# Altium schematic sheet ADC.SchDoc: ADC
size OrCAD A; DocumentNumber: LM-003; Revision: C; SheetNumber: 4; SheetTotal: 4
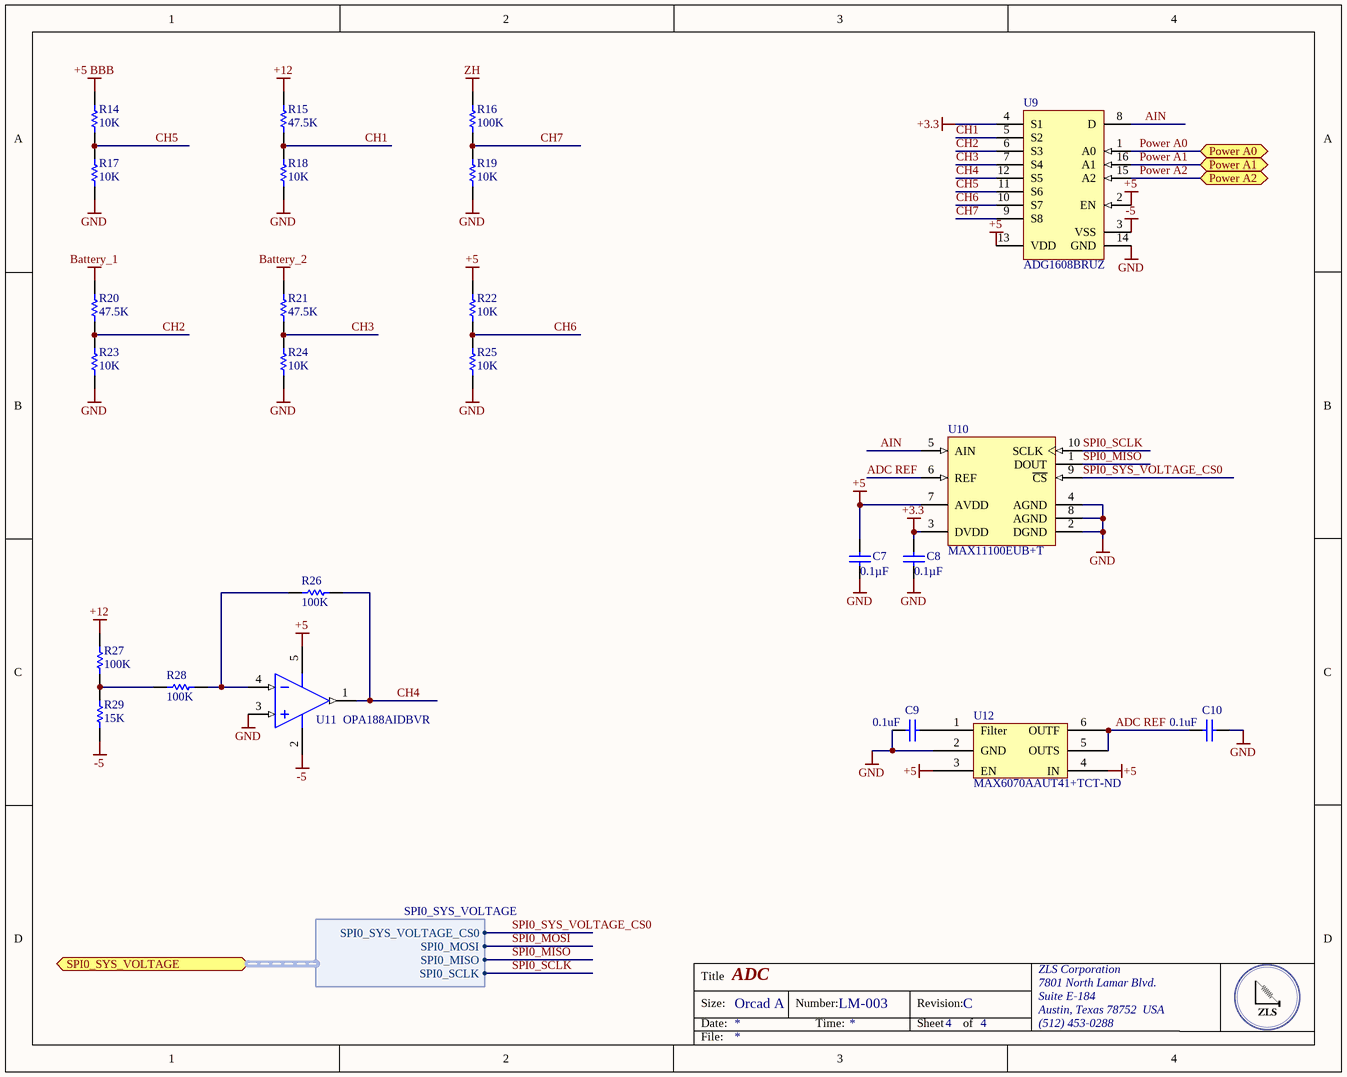
[diagram p0: ADC.SchDoc]

## Parts
C7  Capacitance: 0.1µF  [CAPC0805(2012)145_N]  (hidden comment: CAP CER 0.1UF 25V X7R 0805)
C8  Capacitance: 0.1µF  [CAPC0805(2012)145_N]  (hidden comment: CAP CER 0.1UF 25V X7R 0805)
C9  0.1uF  [CAPC0402(1005)60_L]
C10  0.1uF  [CAPC0402(1005)60_L]
R14  10K  [RESC0805(2012)_L]
R15  47.5K  [RESC0805(2012)_L]
R16  100K  [RESC0805(2012)_L]
R17  10K  [RESC0805(2012)_L]
R18  10K  [RESC0805(2012)_L]
R19  10K  [RESC0805(2012)_L]
R20  47.5K  [RESC0805(2012)_L]
R21  47.5K  [RESC0805(2012)_L]
R22  10K  [RESC0805(2012)_L]
R23  10K  [RESC0805(2012)_L]
R24  10K  [RESC0805(2012)_L]
R25  10K  [RESC0805(2012)_L]
R26  100K  [RESC0805(2012)_L]
R27  100K  [RESC0805(2012)_L]
R28  100K  [RESC0805(2012)_L]
R29  15K  [RESC0805(2012)_L]
U9  ADG1608BRUZ  [ADI-RU-16_M]
U10  MAX11100EUB+T  [U10+2_L]
U11  OPA188AIDBVR  [DBV0005A_M]
U12  Supplier Part Number 1: MAX6070AAUT41+TCT-ND  [SOT95P280X445-6N]  (hidden comment: MAX6070AAUT41+T)

## Ports
Power A0, Power A1, Power A2, SPI0_SYS_VOLTAGE (harness SPI0_SYS_VOLTAGE)

## Harnesses
SPI0_SYS_VOLTAGE: SPI0_SYS_VOLTAGE_CS0, SPI0_MOSI, SPI0_MISO, SPI0_SCLK

## Nets
+3.3: C8.1 U9.4(S1) U10.3(DVDD)
+5: C7.1 R22.1 U9.2(EN) U9.13(VDD) U10.7(AVDD) U11.5(V+) U12.3(EN) U12.4(IN)
+5 BBB: R14.1
+12: R15.1 R27.1
-5: R29.2 U9.3(VSS) U11.2(V-)
Battery_1: R20.1
Battery_2: R21.1
GND: C7.2 C8.2 C9.2 C10.1 R17.2 R18.2 R19.2 R23.2 R24.2 R25.2 U9.14(GND) U10.2(DGND) U10.4(AGND) U10.8(AGND) U11.3(IN+) U12.2(GND)
ZH: R16.1
ADC REF: C10.2 U10.6(REF) U12.5(OUTS) U12.6(OUTF)
AIN: U9.8(D) U10.5(AIN)
CH1: R15.2 R18.1 U9.5(S2)
CH2: R20.2 R23.1 U9.6(S3)
CH3: R21.2 R24.1 U9.7(S4)
CH4: R26.2 U9.12(S5) U11.1(OUT)
CH5: R14.2 R17.1 U9.11(S6)
CH6: R22.2 R25.1 U9.10(S7)
CH7: R16.2 R19.1 U9.9(S8)
Power A0: U9.1(A0) ; port Power A0
Power A1: U9.16(A1) ; port Power A1
Power A2: U9.15(A2) ; port Power A2
SPI0_MISO: U10.1(DOUT) ; port SPI0_SYS_VOLTAGE.SPI0_MISO
SPI0_MOSI: port SPI0_SYS_VOLTAGE.SPI0_MOSI
SPI0_SCLK: U10.10(SCLK) ; port SPI0_SYS_VOLTAGE.SPI0_SCLK
SPI0_SYS_VOLTAGE_CS0: U10.9(~{CS}) ; port SPI0_SYS_VOLTAGE.SPI0_SYS_VOLTAGE_CS0
NetC9_1: C9.1 U12.1(Filter)
NetR26_1: R26.1 R28.2 U11.4(IN-)
NetR27_2: R27.2 R28.1 R29.1

## Notes on the sheet
- Title
- Size:
- Date:
- Orcad A
- Number:
- Time:
- Revision:
- Sheet
- of
- ZLS Corporation
- 7801 North Lamar Blvd.
- Suite E-184
- Austin, Texas 78752  USA
- (512) 453-0288
- File:

## Library data of the parts
C7 C8 = CMP-1036-04795-1: Manufacturer: Murata Electronics North America; Manufacturer Part Number: GRM21BR71E104KA01L; Tolerance: ±10%; Supplier 1: Digi-Key; Supplier Part Number 1: 490-1673-6-ND; RoHS: RoHS Compliant; Category: Capacitors; Stock 1: 891652; Pricing 1: 1=0.2, 10=0.145, 100=0.0683, 500=0.04788, 1000=0.03964 (USD); Packaging: Digi-Reel®; Part Status: Active; Voltage - Rated: 25V; Temperature Coefficient: X7R; Operating Temperature: -55°C ~ 125°C; Features: -; Ratings: -; Applications: General Purpose; Mounting Type: Surface Mount, MLCC; Package / Case: 0805 (2012 Metric); Size / Dimension: 0.079" L x 0.049" W (2.00mm x 1.25mm); Height - Seated (Max): -; Thickness (Max): 0.053" (1.35mm); Lead Spacing: -; Lead Style: -; ComponentLink1URL: http://www.murata.com/~/media/webrenewal/support/library/catalog/products/capacitor/mlcc/c02e.ashx; ComponentLink1Description: http://www.murata.com/~/media/webrenewal/support/library/catalog/products/capacitor/mlcc/c02e.ashx
C9 C10 = CMP-1034-00252-1: CAP CER 0.1UF 10V X7R 0402; Manufacturer: Murata Electronics North America; Manufacturer Part Number: GRM155R71A104KA01D; Tolerance: ±10%; Supplier 1: Digi-Key; Supplier Part Number 1: 490-6321-1-ND; RoHS: RoHS Compliant; Category: Capacitors; Stock 1: 2920395; Pricing 1: 1=0.1, 10=0.014, 100=0.0063, 500=0.00446, 1000=0.00351, 2500=0.00319, 5000=0.00293 (USD); Packaging: Cut Tape (CT); Part Status: Active; Voltage - Rated: 10V; Temperature Coefficient: X7R; Operating Temperature: -55°C ~ 125°C; Features: -; Ratings: -; Applications: General Purpose; Mounting Type: Surface Mount, MLCC; Package / Case: 0402 (1005 Metric); Size / Dimension: 0.039" L x 0.020" W (1.00mm x 0.50mm); Height - Seated (Max): -; Thickness (Max): 0.022" (0.55mm); Lead Spacing: -; ComponentLink1URL: http://www.murata.com/~/media/webrenewal/support/library/catalog/products/capacitor/mlcc/c02e.ashx?la=en-us; ComponentLink1Description: http://www.murata.com/~/media/webrenewal/support/library/catalog/products/capacitor/mlcc/c02e.ashx?la=en-us
R14 R17-R19 R22-R25 = CMP-1013-00215-1: RES SMD 10K OHM 1% 1/8W 0805; Manufacturer: Yageo; Manufacturer Part Number: AT0603FRE0710KL; Description: RES SMD 10K OHM 1% 1/10W 0603; Power (Watts): 0.1W, 1/10W; Temperature Coefficient: ±50ppm/°C; Supplier 1: Digi-Key; Supplier Part Number 1: YAG2122CT-ND; RoHS: RoHS Compliant; Category: Resistors; Stock 1: 13100; Pricing 1: 1=0.2, 10=0.17, 100=0.0664, 1000=0.02778, 2500=0.02546 (USD); Packaging: Cut Tape (CT); Part Status: Active; Tolerance: ±1%; Composition: Thin Film; Features: Anti-Sulfur, Automotive AEC-Q200, Moisture Resistant; Operating Temperature: -55°C ~ 155°C; Package / Case: 0603 (1608 Metric); Supplier Device Package: 0603; Size / Dimension: 0.063" L x 0.032" W (1.60mm x 0.80mm); Height - Seated (Max): 0.022" (0.55mm); Failure Rate: -; ComponentLink1URL: http://www.yageo.com/documents/recent/PYu-AT_51_RoHS_L_5.pdf; ComponentLink1Description: http://www.yageo.com/documents/recent/PYu-AT_51_RoHS_L_5.pdf
R15 R20 R21 = CMP-1013-00215-1: RES SMD 47.5K OHM 1% 1/10W 0805; Manufacturer: Yageo; Manufacturer Part Number: RT0603FRE0747K5L; Description: RES SMD 47.5K OHM 1% 1/10W 0603; Power (Watts): 0.1W, 1/10W; Temperature Coefficient: ±50ppm/°C; Supplier 1: Digi-Key; Supplier Part Number 1: YAG5964CT-ND; RoHS: RoHS Compliant; Category: Resistors; Stock 1: 5000; Pricing 1: 1=0.1, 10=0.068, 100=0.0275, 1000=0.01236, 2500=0.01073 (USD); Packaging: Cut Tape (CT); Part Status: Active; Tolerance: ±1%; Composition: Thin Film; Features: -; Operating Temperature: -55°C ~ 155°C; Package / Case: 0603 (1608 Metric); Supplier Device Package: 0603; Size / Dimension: 0.063" L x 0.032" W (1.60mm x 0.80mm); Height - Seated (Max): 0.022" (0.55mm); Failure Rate: -; ComponentLink1URL: http://www.yageo.com/documents/recent/PYu-RT_1-to-0.01_RoHS_L_9.pdf; ComponentLink1Description: http://www.yageo.com/documents/recent/PYu-RT_1-to-0.01_RoHS_L_9.pdf
R16 R26-R28 = CMP-1013-00215-1: RES SMD 100K OHM 1% 1/10W 0805; Manufacturer: Vishay Beyschlag; Manufacturer Part Number: MCS04020C1003FE000; Description: RES SMD 100K OHM 1% 1/10W 0402; Power (Watts): 0.1W, 1/10W; Temperature Coefficient: ±50ppm/°C; Supplier 1: Digi-Key; Supplier Part Number 1: MCS0402-100K-CFCT-ND; RoHS: RoHS Compliant; Category: Resistors; Stock 1: 3521; Pricing 1: 1=0.3, 10=0.254, 100=0.0993, 1000=0.04158, 2500=0.03812, 5000=0.03465 (USD); Packaging: Cut Tape (CT); Part Status: Active; Tolerance: ±1%; Composition: Thin Film; Features: Anti-Sulfur; Operating Temperature: -55°C ~ 155°C; Package / Case: 0402 (1005 Metric); Supplier Device Package: 0402; Size / Dimension: 0.039" L x 0.020" W (1.00mm x 0.50mm); Height - Seated (Max): 0.015" (0.37mm); Failure Rate: -; ComponentLink1URL: http://www.vishay.com/docs/28705/mcx0x0xpro.pdf; ComponentLink1Description: http://www.vishay.com/docs/28705/mcx0x0xpro.pdf
R29 = CMP-1013-00215-1: RES SMD 15K OHM 1% 1/10W 0805; Manufacturer: Vishay Beyschlag; Manufacturer Part Number: MCS04020C1502FE000; Description: RES SMD 15K OHM 1% 1/10W 0402; Power (Watts): 0.1W, 1/10W; Temperature Coefficient: ±50ppm/°C; Supplier 1: Digi-Key; Supplier Part Number 1: 749-1555-1-ND; RoHS: RoHS Compliant; Category: Resistors; Stock 1: 91476; Pricing 1: 1=0.3, 10=0.254, 100=0.0993, 1000=0.04158, 2500=0.03812, 5000=0.03465 (USD); Packaging: Cut Tape (CT); Part Status: Active; Tolerance: ±1%; Composition: Thin Film; Features: Anti-Sulfur; Operating Temperature: -55°C ~ 155°C; Package / Case: 0402 (1005 Metric); Supplier Device Package: 0402; Size / Dimension: 0.039" L x 0.020" W (1.00mm x 0.50mm); Height - Seated (Max): 0.015" (0.37mm); Failure Rate: -; ComponentLink1URL: http://www.vishay.com/docs/28705/mcx0x0xpro.pdf; ComponentLink1Description: http://www.vishay.com/docs/28705/mcx0x0xpro.pdf
U9 = CMP-0793-00136-1: 4.5 Ohm Ron, 8-Channel +/-5 V,+12 V, +5 V and +3.3 V Multiplexer, 16-pin SOP (RU-16), Tube; Manufacturer: Analog Devices Inc.; Multiplexer/Demultiplexer Circuit: 8:1; On-State Resistance (Max): 4.5 Ohm; Channel-to-Channel Matching (&Delta;Ron): 120 mOhm; Voltage - Supply, Single (V+): 3.3 V ~ 16 V; Voltage - Supply, Dual (V±): ±3.3 V ~ 8 V; Switch Time (Ton, Toff) (Max): 94ns, 93ns; -3db Bandwidth: 40MHz; Charge Injection: 29pC; Channel Capacitance (CS(off), CD(off)): 19pF, 117pF; Current - Leakage (IS(off)) (Max): 100pA; Crosstalk: -64dB @ 1MHz; Supplier 1: Digi-Key; Supplier Part Number 1: ADG1608BRUZ-ND; Manufacturer Part Number: ADG1608BRUZ; RoHS: RoHS Compliant; Category: Integrated Circuits (ICs); Stock 1: 1151; Pricing 1: 1=9.31, 96=8.01552, 192=6.95979, 576=6.0605 (USD); Packaging: Tube; Part Status: Active; Switch Circuit: -; Operating Temperature: -40°C ~ 125°C (TA); Package / Case: 16-TSSOP (0.173", 4.40mm Width); Supplier Device Package: 16-TSSOP; Base Part Number: ADG1608; ComponentLink1URL: http://www.analog.com/media/en/technical-documentation/data-sheets/ADG1608_1609.pdf; ComponentLink1Description: http://www.analog.com/media/en/technical-documentation/data-sheets/ADG1608_1609.pdf
U10 = CMP-0249-00017-1: IC ADC 16BIT SRL 200KSPS 10UMAX; Manufacturer: Maxim Integrated; Number of Bits: 16; Sampling Rate (Per Second): 200k; Number of Inputs: 1; Input Type: Single Ended; Data Interface: SPI; Configuration: S/H-ADC; Ratio - S/H:ADC: 1:1; Architecture: SAR; Reference Type: External; Voltage - Supply, Analog: 5V; Voltage - Supply, Digital: 2.7 V ~ 5.25 V; Supplier 1: Digi-Key; Supplier Part Number 1: MAX11100EUB+-ND; Manufacturer Part Number: MAX11100EUB+; RoHS: RoHS Compliant; Category: Integrated Circuits (ICs); Stock 1: 927; Pricing 1: 1=5.98, 10=5.855 (USD); Packaging: Tube; Part Status: Active; Features: -; Operating Temperature: -40°C ~ 85°C; Package / Case: 10-TFSOP, 10-MSOP (0.118", 3.00mm Width); Supplier Device Package: 10-uMAX; Base Part Number: MAX11100; ComponentLink1URL: https://datasheets.maximintegrated.com/en/ds/MAX11100.pdf; ComponentLink1Description: https://datasheets.maximintegrated.com/en/ds/MAX11100.pdf
U11 = CMP-0809-00005-2: Precision, Low Noise, Rail-to-Rail Output, Zero-Drift Operational Amplifier, 4 to 36 V, -40 to 125 degC, 5-pin SOT23 (DBV5), Green (RoHS & no Sb/Br); Manufacturer: Texas Instruments; Slew Rate: 0.8 V/µs; Current - Supply: 450µA; Voltage - Supply, Single/Dual (±): 4 V ~ 36 V, ±2 V ~ 18 V; Supplier 1: Digi-Key; Supplier Part Number 1: 296-40438-1-ND; Manufacturer Part Number: OPA188AIDBVR; RoHS: RoHS Compliant; Category: Integrated Circuits (ICs); Stock 1: 1779; Pricing 1: 1=2.46, 10=2.211, 100=1.7771, 500=1.46002, 1000=1.20974 (USD); Packaging: Cut Tape (CT); Part Status: Active; Amplifier Type: Zero-Drift; Output Type: Rail-to-Rail; Operating Temperature: -40°C ~ 125°C; Mounting Type: Surface Mount; Package / Case: SC-74A, SOT-753; Supplier Device Package: SOT-23-5; ComponentLink1URL: http://www.ti.com/lit/ds/symlink/opa188.pdf; ComponentLink1Description: http://www.ti.com/lit/ds/symlink/opa188.pdf
U12 = MAX6070AAUT41+T: IC VREF SERIES 4.096V SOT23; Manufacturer: Maxim Integrated; Output Type: Fixed; Tolerance: ±0.04%; Temperature Coefficient: 6ppm/°C; Noise - 0.1Hz to 10Hz: 9.6µVp-p; Noise - 10Hz to 10kHz: 9µVrms; Voltage - Input: 4.3 V ~ 5.5 V; Current - Supply: 350µA; Supplier 1: Digi-Key; Manufacturer Part Number: MAX6070AAUT41+T; RoHS: RoHS Compliant; Category: Integrated Circuits (ICs); Stock 1: 2623; Pricing 1: 1=3.41, 10=3.213, 25=2.5704, 50=2.4418, 100=2.2491, 250=2.13344, 500=2.05634 (USD); Packaging: Cut Tape (CT); Part Status: Active; Reference Type: Series; Voltage - Output (Min/Fixed): 4.096V; Operating Temperature: -40°C ~ 125°C (TA); Mounting Type: Surface Mount; Package / Case: SOT-23-6; Supplier Device Package: SOT-23-6; ComponentLink1URL: https://datasheets.maximintegrated.com/en/ds/MAX6070-MAX6071.pdf; ComponentLink1Description: https://datasheets.maximintegrated.com/en/ds/MAX6070-MAX6071.pdf